# EAGLE schematic TiLDA Mk2 Prototype (EAGLE 6.1)
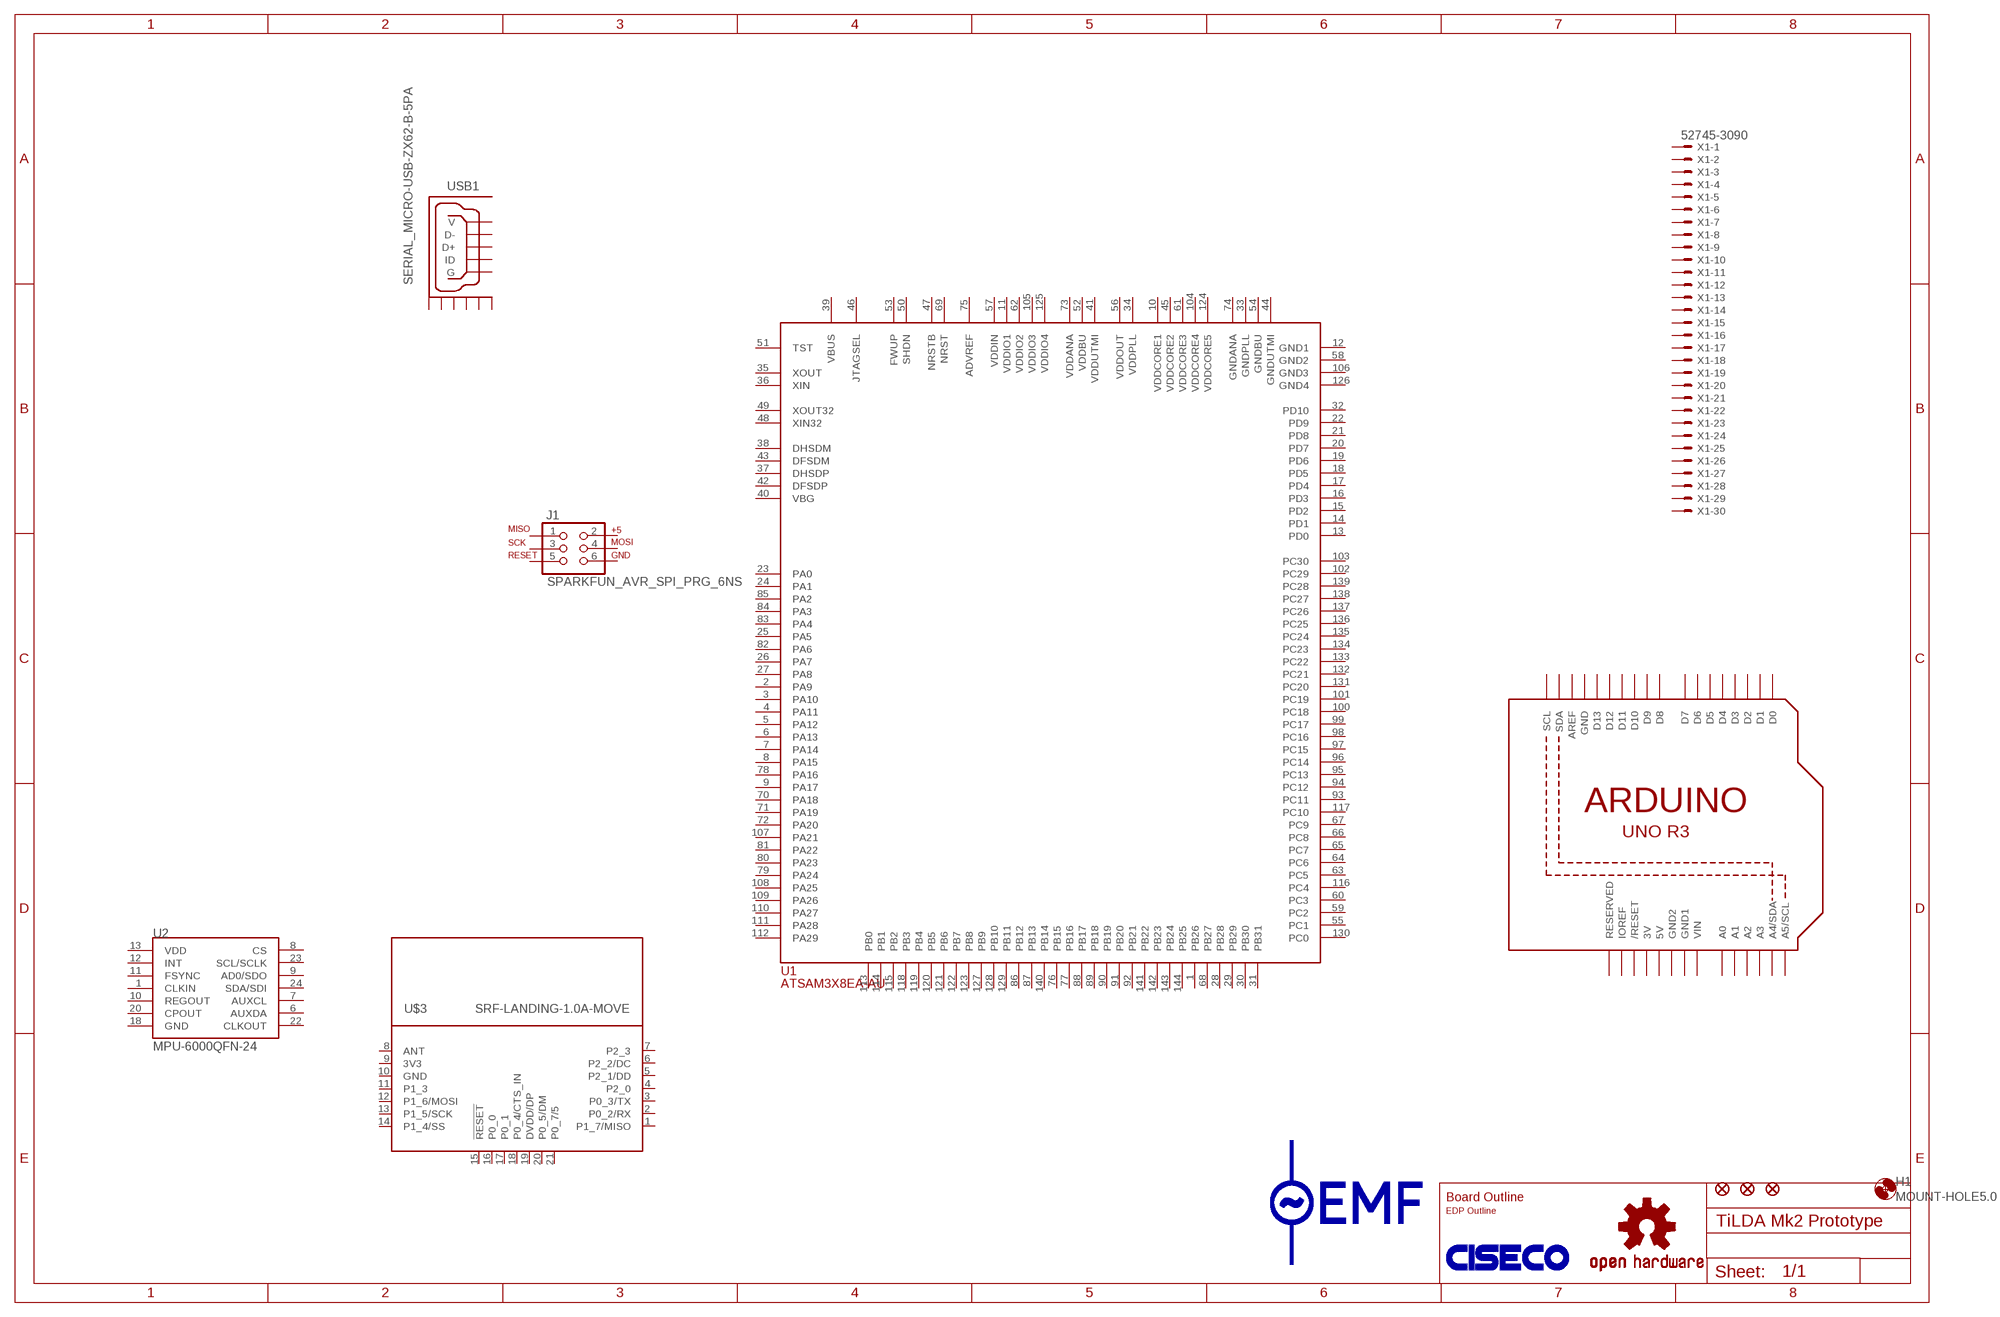
[diagram p0: schematic, sheet 1]

## Parts
H1  MOUNT-HOLE5.0  [5,0]
J1  SPARKFUN_AVR_SPI_PRG_6NS  [SPARKFUN_2X3-NS]
JP1  FIDUCIAL1X2.5-STOP  [FIDUCIAL-1X2.5-STOP]
JP2  FIDUCIAL1X2.5-STOP  [FIDUCIAL-1X2.5-STOP]
JP3  FIDUCIAL1X2.5-STOP  [FIDUCIAL-1X2.5-STOP]
LOGO1  OSHW-LOGOM  [OSHW-LOGO-M]
LOGO2  EMFLOGO-BOTH  [EMFLOGO]
LOGO3  CISECOLOGO-LARGE  [CISECO1]
U1  ATSAM3X8EA-AU  ATSAM3X/AAU  [LQFP144]
U2  MPU-6000QFN-24  [QFN-24-TESTING]
U3  ARDUINOR3-CISECO  [ARDUINOR3-LWKTXT]
U$1  EPD-OUTLINE-2.7"  [EPD-2.7]
U$2  TILDA_BOARDOUTLINE  [TILDA_BADGEBOARDBARE]
U$3  SRF-LANDING-1.0A-MOVE  [SRF-LANDING-1.0A-MOVE]
USB1  SERIAL_MICRO-USB-ZX62-B-5PA  [SERIAL_ZX62-B-5PA]
X1  52745-3090  [52745-3090]
Unconnected: J1.1 J1.2 J1.3 J1.4 J1.5 J1.6 U1.1(PB26) U1.2(PA9) U1.3(PA10) U1.4(PA11) U1.5(PA12) U1.6(PA13) U1.7(PA14) U1.8(PA15) U1.9(PA17) U1.10(VDDCORE1) U1.13(PD0) U1.14(PD1) U1.15(PD2) U1.16(PD3) U1.17(PD4) U1.18(PD5) U1.19(PD6) U1.20(PD7) U1.21(PD8) U1.22(PD9) U1.23(PA0) U1.24(PA1) U1.25(PA5) U1.26(PA7) U1.27(PA8) U1.28(PB28) U1.29(PB29) U1.30(PB30) U1.31(PB31) U1.32(PD10) U1.34(VDDPLL) U1.35(XOUT) U1.36(XIN) U1.37(DHSDP) U1.38(DHSDM) U1.40(VBG) U1.41(VDDUTMI) U1.42(DFSDP) U1.43(DFSDM) U1.45(VDDCORE2) U1.46(JTAGSEL) U1.47(NRSTB) U1.48(XIN32) U1.49(XOUT32) U1.50(SHDN) U1.51(TST) U1.53(FWUP) U1.55(PC1) U1.56(VDDOUT) U1.59(PC2) U1.60(PC3) U1.61(VDDCORE3) U1.63(PC5) U1.64(PC6) U1.65(PC7) U1.66(PC8) U1.67(PC9) U1.68(PB27) U1.69(NRST) U1.70(PA18) U1.71(PA19) U1.72(PA20) U1.76(PB15) U1.77(PB16) U1.78(PA16) U1.79(PA24) U1.80(PA23) U1.81(PA22) U1.82(PA6) U1.83(PA4) U1.84(PA3) U1.85(PA2) U1.86(PB12) U1.87(PB13) U1.88(PB17) U1.89(PB18) U1.90(PB19) U1.91(PB20) U1.92(PB21) U1.93(PC11) U1.94(PC12) U1.95(PC13) U1.96(PC14) U1.97(PC15) U1.98(PC16) U1.99(PC17) U1.100(PC18) U1.101(PC19) U1.102(PC29) U1.103(PC30) U1.104(VDDCORE4) U1.107(PA21) U1.108(PA25) U1.109(PA26) U1.110(PA27) U1.111(PA28) U1.112(PA29) U1.113(PB0) U1.114(PB1) U1.115(PB2) U1.116(PC4) U1.117(PC10) U1.118(PB3) U1.119(PB4) U1.120(PB5) U1.121(PB6) U1.122(PB7) U1.123(PB8) U1.124(VDDCORE5) U1.127(PB9) U1.128(PB10) U1.129(PB11) U1.130(PC0) U1.131(PC20) U1.132(PC21) U1.133(PC22) U1.134(PC23) U1.135(PC24) U1.136(PC25) U1.137(PC26) U1.138(PC27) U1.139(PC28) U1.140(PB14) U1.141(PB22) U1.142(PB23) U1.143(PB24) U1.144(PB25) U2.1(CLKIN) U2.6(AUXDA) U2.7(AUXCL) U2.8(CS) U2.9(AD0/SDO) U2.10(REGOUT) U2.11(FSYNC) U2.12(INT) U2.13(VDD) U2.18(GND) U2.20(CPOUT) U2.22(CLKOUT) U2.23(SCL/SCLK) U2.24(SDA/SDI) U3.A0 U3.A1 U3.A2 U3.A3 U3.A4(A4/SDA) U3.A5(A5/SCL) U3.AREF U3.D0 U3.D1 U3.D2 U3.D3 U3.D4 U3.D5 U3.D6 U3.D7 U3.D8 U3.D9 U3.D10 U3.D11 U3.D12 U3.D13 U3.IOREF U3.RESERVED U3.RESET(/RESET) U3.SCL U3.SDA U$3.1(P1_7/MISO) U$3.2(P0_2/RX) U$3.3(P0_3/TX) U$3.4(P2_0) U$3.5(P2_1/DD) U$3.6(P2_2/DC) U$3.7(P2_3) U$3.8(ANT) U$3.11(P1_3) U$3.12(P1_6/MOSI) U$3.13(P1_5/SCK) U$3.14(P1_4/SS) U$3.15(!RESET) U$3.16(P0_0) U$3.17(P0_1) U$3.18(P0_4/CTS_IN) U$3.19(DVDD/DP) U$3.20(P0_5/DM) U$3.21(P0_7/5) USB1.1(V) USB1.2(D-) USB1.3(D+) USB1.4(ID) USB1.5(G) X1.1 X1.2 X1.3 X1.4 X1.5 X1.6 X1.7 X1.8 X1.9 X1.10 X1.11 X1.12 X1.13 X1.14 X1.15 X1.16 X1.17 X1.18 X1.19 X1.20 X1.21 X1.22 X1.23 X1.24 X1.25 X1.26 X1.27 X1.28 X1.29 X1.30

## Power pins joined to a net without a drawn wire
3V: U3.3V
3V3: U$3.9(3V3)
5V: U3.5V
ADVREF: U1.75(ADVREF)
GND: U3.GND U$3.10(GND)
GND1: U1.12(GND1) U3.GND1 USB1.GND@1(GND1)
GND2: U1.58(GND2) U3.GND2 USB1.GND@2(GND2)
GND3: U1.106(GND3) USB1.GND@3(GND3)
GND4: U1.126(GND4) USB1.GND@4(GND4)
GND5: USB1.GND@5(GND5)
GND6: USB1.GND@6(GND6)
GNDANA: U1.74(GNDANA)
GNDBU: U1.54(GNDBU)
GNDPLL: U1.33(GNDPLL)
GNDUTMI: U1.44(GNDUTMI)
VBUS: U1.39(VBUS)
VDDANA: U1.73(VDDANA)
VDDBU: U1.52(VDDBU)
VDDIN: U1.57(VDDIN)
VDDIO1: U1.11(VDDIO1)
VDDIO2: U1.62(VDDIO2)
VDDIO3: U1.105(VDDIO3)
VDDIO4: U1.125(VDDIO4)
VIN: U3.VIN

## Library data of the parts
H1 = holes:MOUNT-HOLE: MOUNTING HOLE with drill center marker
J1 = TiLDA Mk2 Parts:SPARKFUN_AVR_SPI_PRG_6: AVR ISP 6 Pin This is the reduced ISP connector for AVR programming. Common on Arduino. This footprint will take up less PCB space and can be used with a 10-pin to 6-pin adapter such as SKU: BOB-08508
JP1-JP3 = TiLDA Mk2 Parts:FIDUCIAL: Fiducial Alignment Points Various fiducial points for machine vision alignment.
LOGO1 = TiLDA Mk2 Parts:OSHW-LOGO: Open Source Hardware Logo This logo indicates the piece of hardware it is found on incorporates a OSHW license and/or adheres to the definition of open source hardware found here: http://freedomdefined.org/OSHW
LOGO2 = TiLDA Mk2 Parts:EMFLOGO
LOGO3 = TiLDA Mk2 Parts:CISECOLOGO
U1 = SmartPrj:ATSAM3X/A
U2 = TiLDA Mk2 Parts:MPU-6000: MPU-6000 - I2C address is 0x68 with AD0 low and 0x69 with AD0 high.
U3 = TiLDA Mk2 Parts:ARDUINOR3: This is a new object for the new Arduino R3 - with extra pins that you may want to use (such as IOref, and duplicated A4/A5
U$1 = TiLDA Mk2 Parts:EPD-OUTLINE
U$2 = TiLDA Mk2 Parts:TILDA_BOARDOUTLINE
U$3 = Ciseco Footprints:SRF: SRF Wireless UART Serial Data Module. www.ciseco.co.uk
USB1 = TiLDA Mk2 Parts:SERIAL_MICRO-USB: MICRO USB B, BOTTOM MOUNT
X1 = con-molex:52745-3090: FFC/FPC-to-Board 0.50mm (.020") SMT Top Contact Right Angle, ZIF, Style Receptacle 52745 / 52435 Source: http://www.molex.com/product/ffc/52745.html; OC_FARNELL: unknown; OC_NEWARK: unknown

## Net classes
0 default: width 0.203 mm, drill 0.305 mm, clearance 0.203 mm
1 USB: drill 0.406 mm, clearance 0.203 mm to class 0, clearance 0.406 mm
3 usbvcc: width 0.61 mm, drill 0.508 mm, clearance 0.203 mm to class 0, clearance 0.254 mm